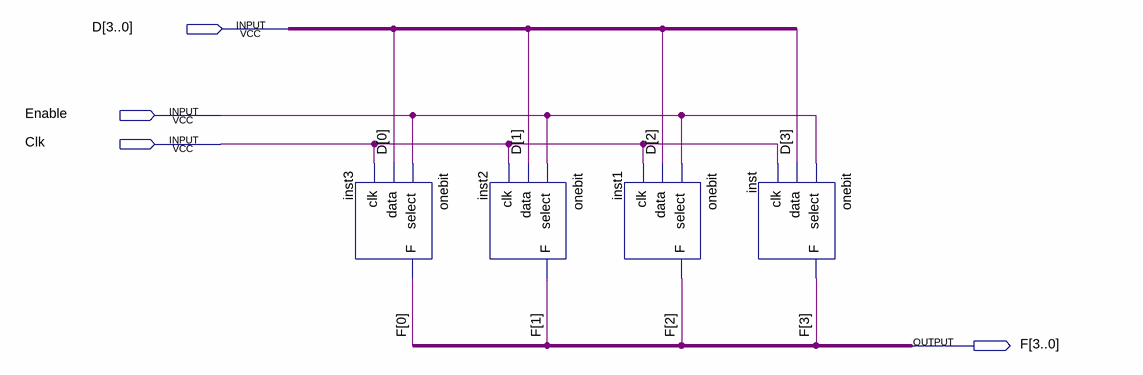
[diagram p0: schematic sheet]
// Quartus schematic 4bitregister.bdf as structural Verilog: 4 symbols, 4 pins
module \4bitregister  (
  input  [3:0] D,
  input  Enable,
  input  Clk,
  output [3:0] F
);

  onebit inst3 (.select(Enable), .data(D[0]), .clk(Clk), .F(F[0]));
  onebit inst2 (.select(Enable), .data(D[1]), .clk(Clk), .F(F[1]));
  onebit inst1 (.select(Enable), .data(D[2]), .clk(Clk), .F(F[2]));
  onebit inst (.select(Enable), .data(D[3]), .clk(Clk), .F(F[3]));
endmodule
